# EAGLE design CK2150_BT (EAGLE 9.6.2)
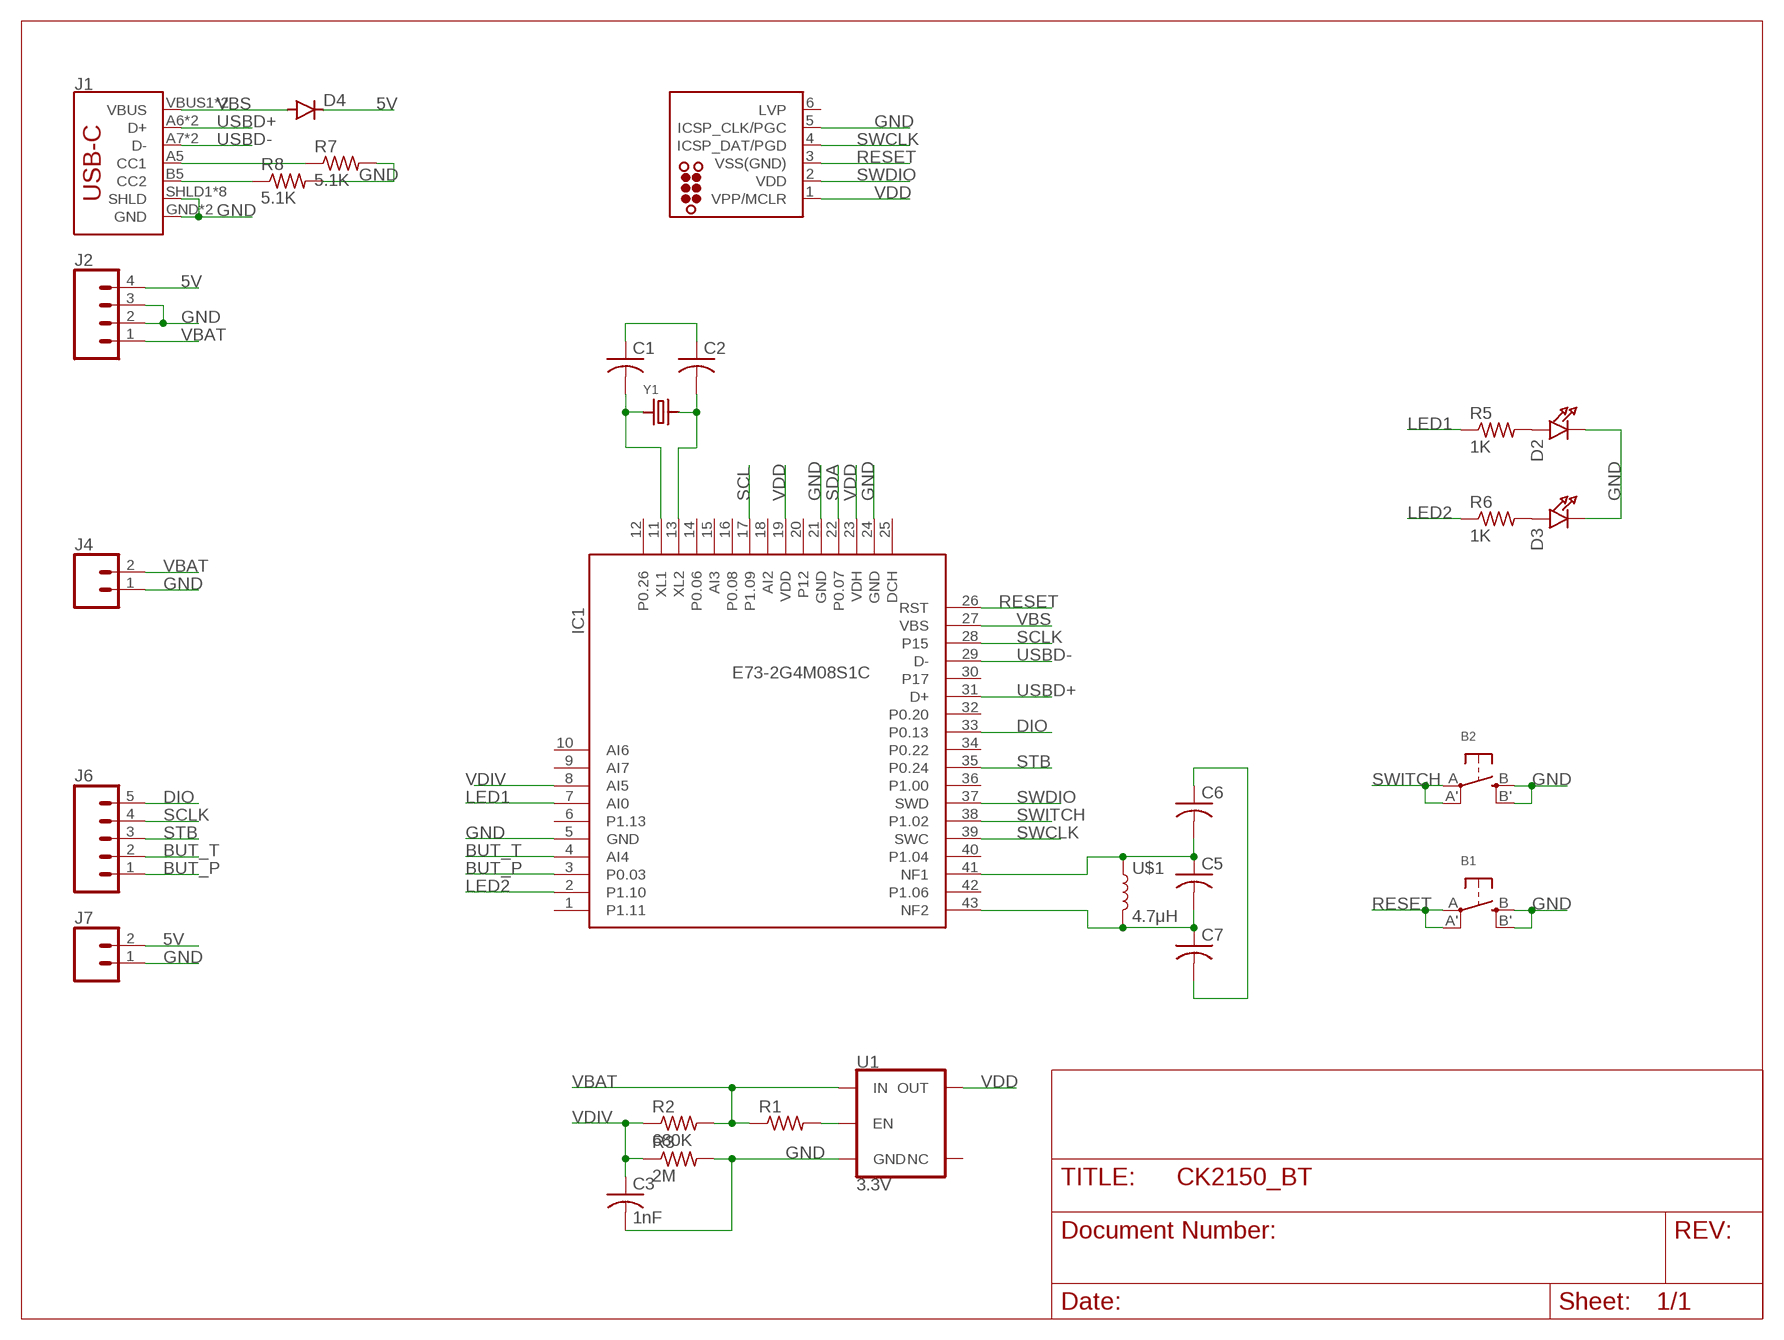
[diagram p0: schematic, sheet 1]

## Parts
B1  SWITCH_TACT_SMT4.6X2.8  [BTN_KMR2_4.6X2.8]
B2  SWITCH_TACT_SMT4.6X2.8  [BTN_KMR2_4.6X2.8]
C1  C-USC0603  [C0603]
C2  C-USC0603  [C0603]
C3  1nF  C-USC0603  [C0603]
C5  C-USC0603  [C0603]
C6  C-USC0603  [C0603]
C7  C-USC0603  [C0603]
D2  LED0805_NOOUTLINE  [CHIPLED_0805_NOOUTLINE]
D3  LED0805_NOOUTLINE  [CHIPLED_0805_NOOUTLINE]
D4  DIODE-SOD123  [SOD123]
IC1  E73-2G4M08S1C  [SMD]
J1  USB_C5  [USB-C-16P-5]
J2  CONN_041X04_NO_SILK  [1X04_NO_SILK]
J3  TC2030-MCP-NL  [TC2030-MCP-NL]
J4  CONN_021X02_NO_SILK  [1X02_NO_SILK]
J6  CONN_05NO_SILK  [1X05_NO_SILK]
J7  CONN_021X02_NO_SILK  [1X02_NO_SILK]
R1  R-US_R0603  [R0603]
R2  680K  R-US_R0603  [R0603]
R3  2M  R-US_R0603  [R0603]
R5  1K  R-US_R0603  [R0603]
R6  1K  R-US_R0603  [R0603]
R7  5.1K  R-US_R0603  [R0603]
R8  5.1K  R-US_R0603  [R0603]
U1  3.3V  V_REG_AP2112K-3.3V  [SOT23-5]
U$1  4.7μH  RFID_ANTENNA_W3102  [W3102]
Y1  CRYSTAL8X3.8SMT  [CRYSTAL_8X3.8]

## Nets
5V: D4.C J2.4 J7.2
BUT_P: IC1.3(P0.03) J6.1
BUT_T: IC1.4(AI4) J6.2
DIO: IC1.33(P0.13) J6.5
GND: B1.B'(S1) B1.B(S) B2.B'(S1) B2.B(S) C1.1 C2.1 C3.2 C6.1 C7.2 D2.C D3.C IC1.5(GND) IC1.21(GND) IC1.24(GND) J1.GND J1.GND2(GND) J1.SHLD1(SHLD) J1.SHLD2(SHLD) J1.SHLD3(SHLD) J1.SHLD4(SHLD) J1.SHLD5(SHLD) J1.SHLD6(SHLD) J1.SHLD7(SHLD) J1.SHLD8(SHLD) J2.2 J2.3 J3.5(ICSP_CLK/PGC) J4.1 J7.1 R3.2 R7.2 R8.2 U1.2(GND)
LED1: IC1.7(AI0) R5.1
LED2: IC1.2(P1.10) R6.1
N$1: R1.2 U1.3(EN)
N$2: J1.A5(CC1) R7.1
N$3: C2.2 IC1.13(XL2) Y1.P$4
N$4: D2.A R5.2
N$5: C5.1 C6.2 IC1.41(NF1) U$1.1
N$6: C5.2 C7.1 IC1.43(NF2) U$1.2
N$7: D3.A R6.2
N$8: J1.B5(CC2) R8.1
N$29: C1.2 IC1.11(XL1) Y1.P$1
RESET: B1.A'(P1) B1.A(P) IC1.26(RST) J3.3(VSS(GND))
SCL: IC1.17(P1.09)
SCLK: IC1.28(P15) J6.4
SDA: IC1.22(P0.07)
STB: IC1.35(P0.24) J6.3
SWCLK: IC1.39(SWC) J3.4(ICSP_DAT/PGD)
SWDIO: IC1.37(SWD) J3.2(VDD)
SWITCH: B2.A'(P1) B2.A(P) IC1.38(P1.02)
USBD+: IC1.31(D+) J1.A6(D+) J1.B6(D+)
USBD-: IC1.29(D-) J1.A7(D-) J1.B7(D-)
VBAT: J2.1 J4.2 R1.1 R2.2 U1.1(IN)
VBS: D4.A IC1.27(VBS) J1.VBUS1(VBUS) J1.VBUS2(VBUS)
VDD: IC1.19(VDD) IC1.23(VDH) J3.1(VPP/MCLR) U1.5(OUT)
VDIV: C3.1 IC1.8(AI5) R2.1 R3.1
Unconnected: IC1.1(P1.11) IC1.6(P1.13) IC1.9(AI7) IC1.10(AI6) IC1.12(P0.26) IC1.14(P0.06) IC1.15(AI3) IC1.16(P0.08) IC1.18(AI2) IC1.20(P12) IC1.25(DCH) IC1.30(P17) IC1.32(P0.20) IC1.34(P0.22) IC1.36(P1.00) IC1.40(P1.04) IC1.42(P1.06) J3.6(LVP) U1.4(NC)

## Library data of the parts
B1 B2 = microbuilder:SWITCH_TACT_SMT: SMT Tact Switches 6x6mm - Digikey: P12940SCT-ND KMR2 (4.6x2.8mm) - Digikey: 401-1426-1-ND EVQ-PQHB55 - Light Touch, 160GF (4.5x4.5mm) - Digikey: P8090SCT-ND
C1-C3 C5-C7 = rcl:C-US: CAPACITOR, American symbol; SPICEPREFIX: C
D2 D3 = microbuilder:LED: LED 0603 - 0603 Surface Mount Package 2mA: Green LED - Low Power (3.9mcd, 2ma, 1.7Vf) - Digikey: 475-2709-2-ND Orange LED - Low Power (9.8mcd, 2ma, 1.8Vf) - Digikey: 475-1194-2-ND Red LED - Low Power (5mcd, 2ma, 1.8Vf) - Digikey: 475-1195-2-ND Yellow LED - Low Power (7mcd, 2ma, 1.8Vf) - Digikey: 475-1196-2-ND 5mA: Blue LED - Low Power (17mcd, 5ma, 2.9Vf) - Digikey: LNJ937W8CRACT-ND 0805 - 0805 Surface Mount Package 2mA: Red LED (8.8mcd, 2mA, 1.8Vf, Clear) - Low Power [Digikey: 475-2510-1-ND] Green LED (5mcd, 2mA, 1.8Vf, Clear) - Low Power [Digikey: 475-2730-1-ND] Yellow LED (11.3mcd, 2mA, 1.8Vf, Clear) - Low Power [Digikey: 475-2555-1-ND] 20mA: Red LED (104mcd, 20mA, Diffused) - LS R976 [Digikey: 475-1278-6-ND] Red LED (12mcd, 20mA, 2.0Vf, Clear) - APT2012EC [Digikey: 754-1128-1-ND] Green LED (15mcd, 20mA, 2.2Vf, Clear) - APT2012GC [Digikey: 754-1131-1-ND] Orange LED (160mcd, 20mA, 2.1Vf, Clear) - APT2012SECK [Digikey: 754-1130-1-ND] 1206 - 1206 Surface Mount Package Green LED (26mcd, 20mA, Diffused) - LG N971 [Digikey: 475-1407-6-ND] Red LED (15mcd, 20mA, Diffused) - LH N974 [Digikey: 475-1416-6-ND]
D4 = diode:DIODE-: DIODE; LCSC: C511872
IC1 = ebyte_E73:E73-2G4M08S1C: nRF52840 2.4GHz SMD Wireless Module
J1 = USBC:USB_C: USB Type C 16Pin Connector Super Speed pins not available on the 16-pin purely SMD connector so this part is best for USB 2.0 implementations. D1 and D2 are tied together enabling D+/- no matter which way the cable is plugged into the connector. The two channel configuration pins (CC1/2) are exposed. These are normally connected to ground via 5.1k resistors but can be reconfigured for high current/high power applications.
J2 = SparkFun-Connectors:CONN_04: Multi connection point. Often used as Generic Header-pin footprint for 0.1 inch spaced/style header connections On any of the 0.1 inch spaced packages, you can populate with these: Break Away Headers - Straight <https://www.sparkfun.com/products/116> (PRT-00116) Break Away Male Headers - Right Angle <https://www.sparkfun.com/products/553> (PRT-00553) Female Headers <https://www.sparkfun.com/products/115> (PRT-00115) Break Away Headers - Machine Pin <https://www.sparkfun.com/products/117> (PRT-00117) Break Away Female Headers - Swiss Machine Pin <https://www.sparkfun.com/products/743> (PRT-00743) For SCREWTERMINALS and SPRING TERMINALS visit here: Screw Terimnals on SparkFun.com <https://www.sparkfun.com/search/results?term=Screw+Terminals> (5mm/3.5mm/2.54mm spacing) This device is also useful as a general connection point to wire up your design to another part of your project. Our various solder wires solder well into these plated through hole pads. Hook-Up Wire - Assortment (Stranded, 22 AWG) <https://www.sparkfun.com/products/11375> (PRT-11375) Hook-Up Wire - Assortment (Solid Core, 22 AWG) <https://www.sparkfun.com/products/11367> (PRT-11367) View the entire wire category on our website here <https://www.sparkfun.com/categories/141> Special notes: Molex polarized connector foot print use with SKU : PRT-08231 with associated crimp pins and housings. 1MM SMD Version SKU: PRT-10208; PROD_ID: CONN-09696
J3 = tag-connect:TC2030: TAG-CONNECT ICSP Connector Manufacturer: Tag-Connect <http://www.tag-connect.com> Cable for easy In-Circuit Serial Programming. Designed for Microchip ICD2, suitable for many others. Two variants - one "with legs" (for hands-free fit on PCB) and another "without legs" for quick programming. PAD Description 1 MCLR/Vpp 2 Vdd 3 GND 4 PGD (ISPDAT) 5 PGC (ISPCLK) 6 nc (used for LVP) ©2009 ROFA.cz - modified and updated by Robert Darlington ‹rdarlington@gmail.com›
J4 J7 = SparkFun-Connectors:CONN_02: Multi connection point. Often used as Generic Header-pin footprint for 0.1 inch spaced/style header connections On any of the 0.1 inch spaced packages, you can populate with these: Break Away Headers - Straight <https://www.sparkfun.com/products/116> (PRT-00116) Break Away Male Headers - Right Angle <https://www.sparkfun.com/products/553> (PRT-00553) Female Headers <https://www.sparkfun.com/products/115> (PRT-00115) Break Away Headers - Machine Pin <https://www.sparkfun.com/products/117> (PRT-00117) Break Away Female Headers - Swiss Machine Pin <https://www.sparkfun.com/products/743> (PRT-00743) For SCREWTERMINALS and SPRING TERMINALS visit here: Screw Terimnals on SparkFun.com <https://www.sparkfun.com/search/results?term=Screw+Terminals> (5mm/3.5mm/2.54mm spacing) This device is also useful as a general connection point to wire up your design to another part of your project. Our various solder wires solder well into these plated through hole pads. Hook-Up Wire - Assortment (Stranded, 22 AWG) <https://www.sparkfun.com/products/11375> (PRT-11375) Hook-Up Wire - Assortment (Solid Core, 22 AWG) <https://www.sparkfun.com/products/11367> (PRT-11367) View the entire wire category on our website here <https://www.sparkfun.com/categories/141> Special notes: Molex polarized connector foot print use with: PRT-08233 with associated crimp pins and housings. 2.54_SCREWTERM for use with PRT-10571. 3.5mm Screw Terminal footprints for PRT-08084 5mm Screw Terminal footprints for use with PRT-08432
J6 = SparkFun-Connectors:CONN_05: Multi connection point. Often used as Generic Header-pin footprint for 0.1 inch spaced/style header connections On any of the 0.1 inch spaced packages, you can populate with these: Break Away Headers - Straight <https://www.sparkfun.com/products/116> (PRT-00116) Break Away Male Headers - Right Angle <https://www.sparkfun.com/products/553> (PRT-00553) Female Headers <https://www.sparkfun.com/products/115> (PRT-00115) Break Away Headers - Machine Pin <https://www.sparkfun.com/products/117> (PRT-00117) Break Away Female Headers - Swiss Machine Pin <https://www.sparkfun.com/products/743> (PRT-00743) For SCREWTERMINALS and SPRING TERMINALS visit here: Screw Terimnals on SparkFun.com <https://www.sparkfun.com/search/results?term=Screw+Terminals> (5mm/3.5mm/2.54mm spacing) This device is also useful as a general connection point to wire up your design to another part of your project. Our various solder wires solder well into these plated through hole pads. Hook-Up Wire - Assortment (Stranded, 22 AWG) <https://www.sparkfun.com/products/11375> (PRT-11375) Hook-Up Wire - Assortment (Solid Core, 22 AWG) <https://www.sparkfun.com/products/11367> (PRT-11367) View the entire wire category on our website here <https://www.sparkfun.com/categories/141> Special notes: Molex polarized connector foot print use with SKU : PRT-08231 with associated crimp pins and housings. 1MM SMD Version SKU: PRT-10208
R1-R3 R5-R8 = rcl:R-US_: RESISTOR, American symbol; SPICEPREFIX: R
U1 = SparkFun-IC-Power:V_REG_AP2112: AP2112 - 600mA CMOS LDO Regulator w/ Enable The AP2112 is CMOS process low dropout linear regulator with enable function, the regulator delivers a guaranteed 600mA (min.) continuous load current. Features Output Voltage Accuracy: ±1.5% Output Current: 600mA (Min.) Foldback Short Current Protection: 50mA Enable Function to Turn ON/OFF VOUT Low Dropout Voltage (3.3V): 250mV (Typ.) @IOUT=600mA Excellent Load Regulation: 0.2%/A (Typ.) Excellent Line Regulation: 0.02%/V (Typ.) Low Quiescent Current: 55μA (Typ.) Low Standby Current: 0.01μA (Typ.) Low Output Noise: 50μVRMS PSRR: 100Hz -65dB, 1kHz -65dB OTSD Protection Stable with 1.0μF Flexible Cap: Ceramic, Tantalum and Aluminum Electrolytic Operation Temperature Range: -40°C to 85°C ESD: MM 400V, HBM 4000V; PROD_ID: VREG-12457
U$1 = SparkFun-RF:RFID_ANTENNA_W3102: W3102 Pulse Larsen NFC / RFID SMD Antenna 13.56MHz 4.7μH; PROD_ID: ANT-16333
Y1 = microbuilder:CRYSTAL: Crystals HC49UP - Surface Mount Crystal 4.0MHz 18pF +/-30ppm Surface Mount Crystal [Digikey: 535-9857-1-ND] 12.0 MHz Surface Mount Crystal [Digikey: 535-9869-6-ND] 25.0 MHz Surface Mount Crystal [Digikey: 535-9078-1-ND] 2.5 x 2.0mm - MEMs SMT Crystal 16.0 MHz 10pF 20ppm 2.5 x 2.0mm Crystal [Digikey -40-85°C: 535-10923-1-ND] 3.2 x 2.5mm - MEMs SMT Crystal 12.0 MHz 8pF 15ppm 3.2 x 2.5mm Crystal [Digikey: -10-70°C: 644-1047-1-ND -40-125°C: 644-1128-1-ND] 16.0 MHz 8pF 15ppm 3.2 x 2.5mm Crystal [Digikey: -10-70°C: 644-1049-1-ND -40-125°C: 644-1129-2-ND] 16.0 MHz 10pF 10ppm 3.2 x 2.5mm Crystal [Digikey: 644-1100-1-ND] 27.12 MHz 18pF 30ppm 3.2 x 2.5mm Crystal [Digikey: 887-1424-1-ND] 27.12MHz 10pF 10ppm 3.2 x 2.5mm Crystal [Digikey: 887-1329-1-ND] 4.9 x 1.8mm - MEMs SMT Crystal 32.768 KHz 12.5pF 20ppm 4.9 x 1.8mm Crystal [Digikey: SE2415CT-ND] 8.0 x 3.8mm - Surface Mount Crystal 32.768kHz 12.5pF 20ppm -40°C-85°C [Digikey: 535-9166-2-ND] Cylinder 32.768KHz Cylinder Crystal (2x6mm body) [Ex. Digikey: 300-8341-2-ND]

## Board
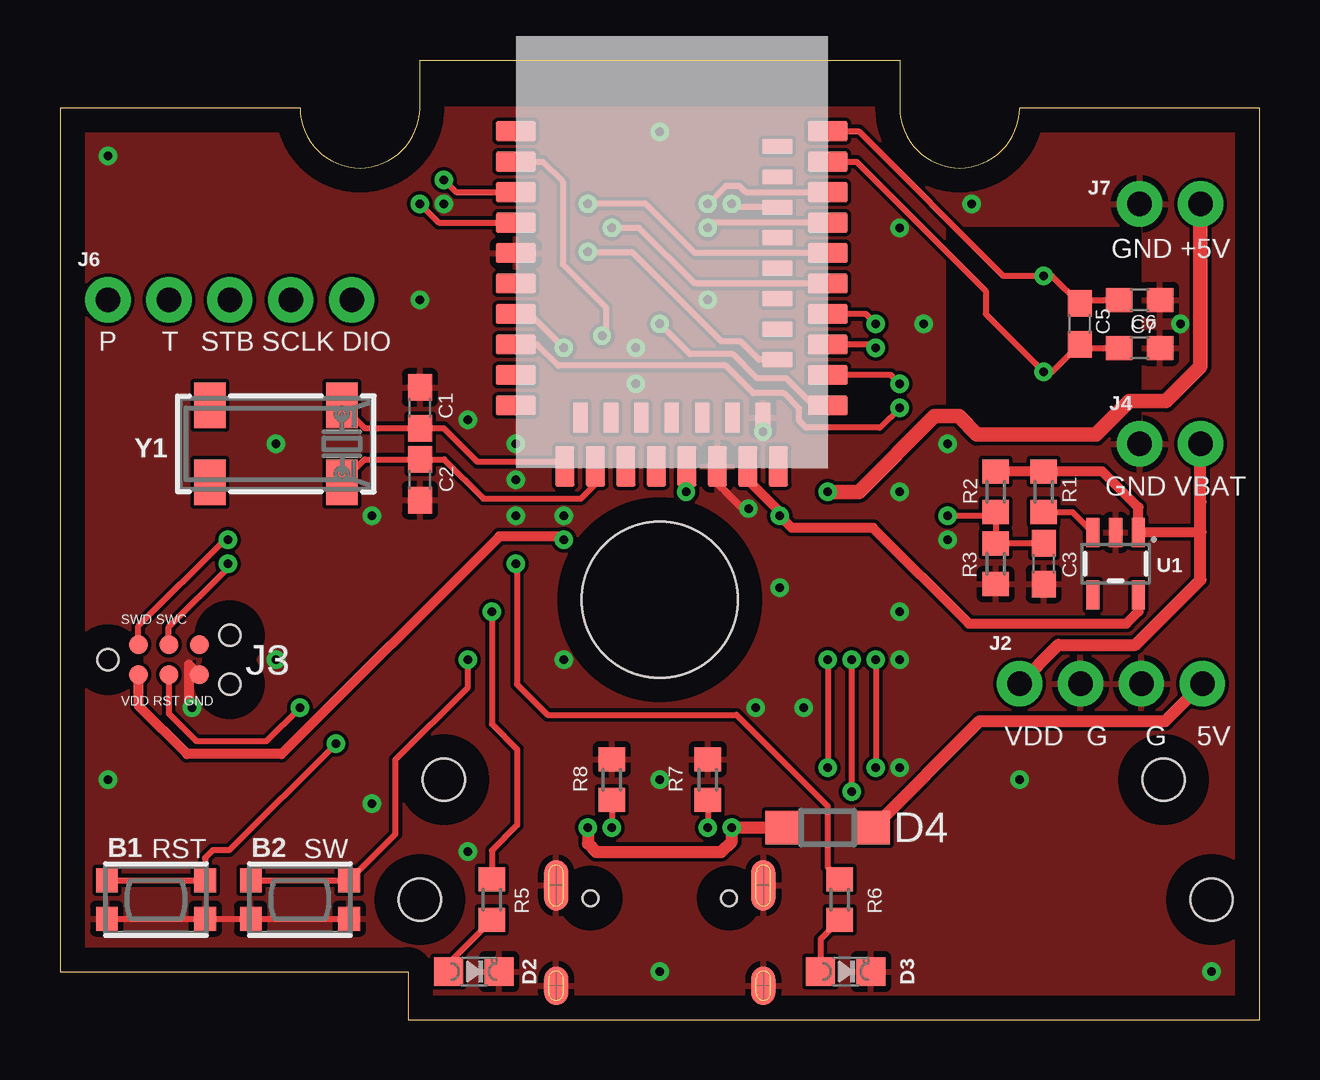
[diagram p1: board, top side]
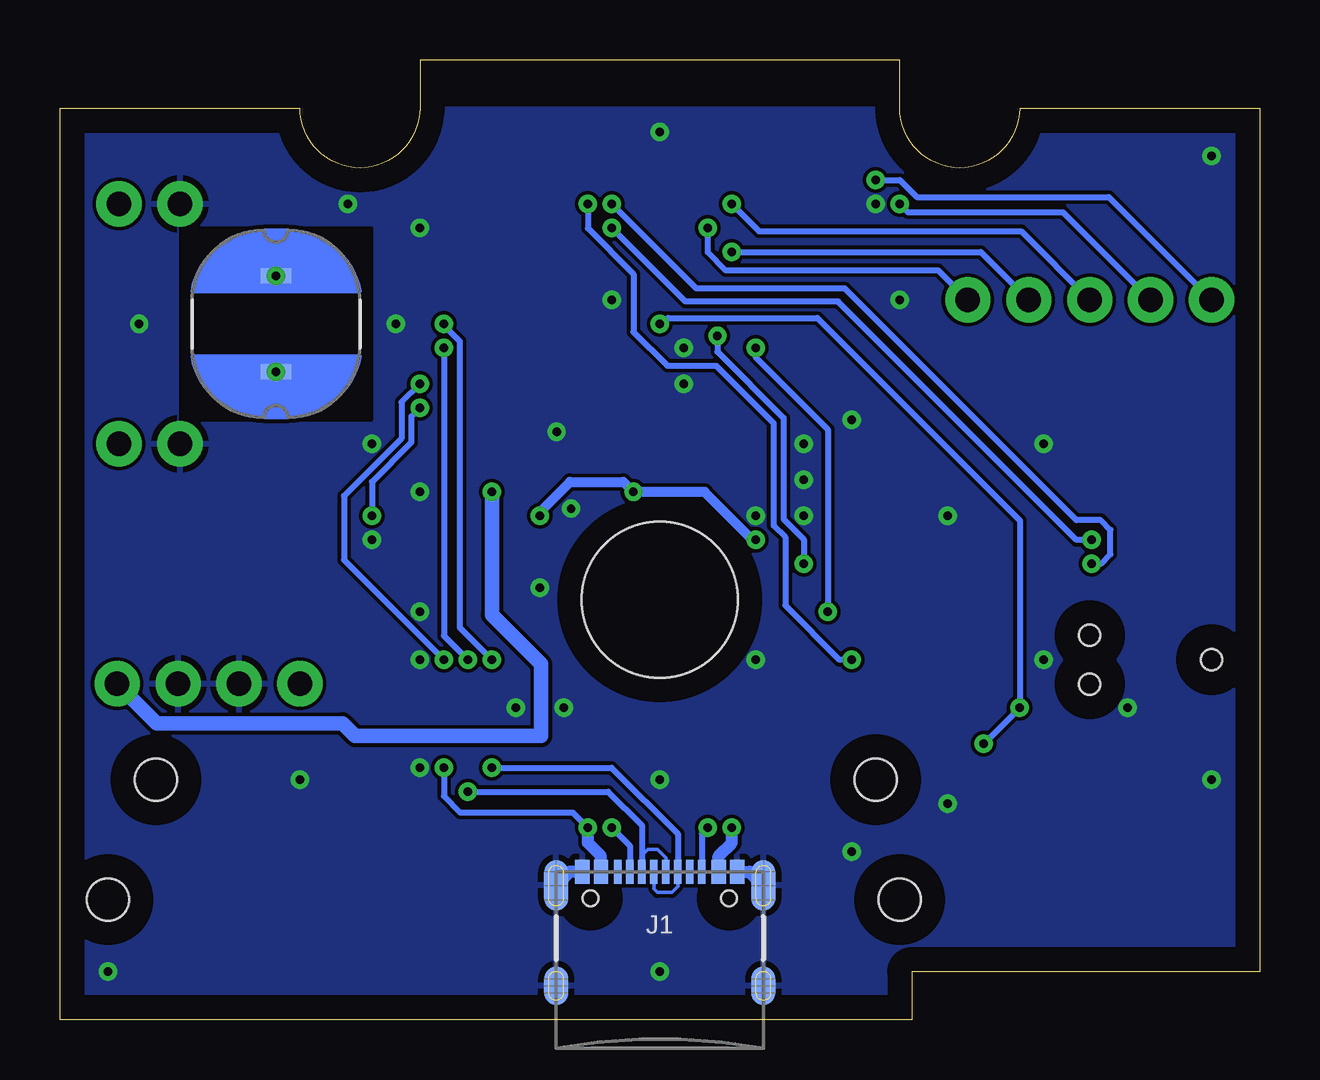
[diagram p2: board, bottom side, seen from below]

Size 50 x 40 mm. Coordinates in mm from the lower left corner, seen from the top.
Outline: 14.5,0 50,0 50,38 40,38 arc-180 35,38 35,40 15,40 15,38 arc-180 10,38 0,38 0,2 14.5,2 14.5,0
Copper layers (1*16): Top 0.035mm / dielectric 1.5mm / Bottom 0.035mm
Design rules "default *": minimum track width 6mil, minimum drill 0.35mm, track to track 6mil, track to pad 6mil, pad to pad 6mil, via to via 6mil, smd to smd 6mil, copper to edge 40mil, drill to drill 6mil, minimum pad ring 10mil, minimum via ring 8mil, stop-mask expansion 4mil, vias tented up to drill 100mil, thermal gap 10mil
Holes 1.75 mm at 15,5 48,5 16,10 46,10
Holes 6.5 mm at 25,17.5

### Footprints (pad centres in the part's own frame; a part is rotated, then mirrored left to right if it is on the bottom)
BTN_KMR2_4.6X2.8 = smd 0.9 x 1: A 2.05,0.8; A' -2.05,0.8; B 2.05,-0.8; B' -2.05,-0.8
C0603 = smd 1.1 x 1: 1 -0.85,0; 2 0.85,0
CHIPLED_0805_NOOUTLINE = smd 1.2 x 1.2: A 0,-1.05; C 0,1.05
SOD123 = smd 1.4 x 1.4: A 1.9,0; C -1.9,0
SMD = smd 1.676 x 0.813: 1 13,3.97; 2 13,5.24; 3 13,6.51; 4 13,7.78; 5 13,9.05; 6 13,10.32; 7 13,11.59; 8 13,12.86; 9 13,14.13; 10 13,15.4; 26 0,15.4; 27 0,14.13; 29 0,12.86; 31 0,11.59; 33 0,10.32; 35 0,9.05; 37 0,7.78; 39 0,6.51; 41 0,5.24; 43 0,3.97 | smd 0.813 x 1.676: 11 10.95,17.94; 13 9.68,17.94; 15 8.41,17.94; 17 7.14,17.94; 19 5.87,17.94; 21 4.6,17.94; 23 3.33,17.94; 25 2.06,17.94 | smd 0.635 x 1.27: 12 10.31,15.9; 14 9.04,15.9; 16 7.77,15.9; 18 6.5,15.9; 20 5.23,15.9; 22 3.96,15.9; 24 2.69,15.9 | smd 1.27 x 0.635: 28 2.1,13.495; 30 2.1,12.225; 32 2.1,10.955; 34 2.1,9.685; 36 2.1,8.415; 38 2.1,7.145; 40 2.1,5.875; 42 2.1,4.605
USB-C-16P-5 = smd 0.3 x 1: A5 -1.25,-0.34; A6 -0.25,-0.34; A7 0.25,-0.34; A8 1.25,-0.34; B5 1.75,-0.34; B6 0.75,-0.34; B7 -0.75,-0.34; B8 -1.75,-0.34 | smd 0.6 x 1: GND -3.225,-0.34; GND2 3.225,-0.34; VBUS1 -2.45,-0.34; VBUS2 2.45,-0.34 | smd 1 x 2.1: SHLD1 -4.32,-0.915; SHLD2 4.32,-0.915 | smd 1 x 2.1 bottom: SHLD3 -4.32,-0.915; SHLD4 4.32,-0.915 | smd 1 x 1.6: SHLD5 -4.32,-5.095; SHLD8 4.32,-5.095 | smd 1 x 1.6 bottom: SHLD6 -4.32,-5.095; SHLD7 4.32,-5.095 | hole 0.65: -2.89,-1.445; 2.89,-1.445
1X04_NO_SILK = drill 1.016 pad 1.88: 1 0,0; 2 2.54,0; 3 5.08,0; 4 7.62,0
TC2030-MCP-NL = smd 0.787 x 0.787: 1 1.27,-0.635; 2 1.27,0.635; 3 2.54,-0.635; 4 2.54,0.635; 5 3.81,-0.635; 6 3.81,0.635 | hole 0.889: 0,0; 5.08,-1.016; 5.08,1.016
1X02_NO_SILK = drill 1.016 pad 1.88: 1 0,0; 2 2.54,0
1X05_NO_SILK = drill 1.016 pad 1.88: 1 0,0; 2 2.54,0; 3 5.08,0; 4 7.62,0; 5 10.16,0
R0603 = smd 1 x 1.1: 1 -0.85,0; 2 0.85,0
SOT23-5 = smd 0.55 x 1.2: 1 -0.95,-1.3; 2 0,-1.3; 3 0.95,-1.3; 4 0.95,1.3; 5 -0.95,1.3
W3102 = smd 1.27 x 0.635: 1 0,2; 2 0,-2
CRYSTAL_8X3.8 = smd 1.3 x 1.9: P$1 -2.75,-1.6; P$2 2.75,-1.6; P$3 2.75,1.6; P$4 -2.75,1.6

### Placement (x,y rotation side)
B1  4,5 0 top
B2  10,5 0 top
C1  15,25.5 270 top
C2  15,22.5 90 top
C3  41,19 270 top
C5  42.5,29 90 top
C6  45,28 180 top
C7  45,30 0 top
D2  17.25,2 270 top
D3  32.75,2 270 top
D4  32,8 180 top
IC1  32,41 180 top
J1  25,6.5 0 bottom
J2  40,14 0 top
J3  2,15 0 top
J4  45,24 0 top
J6  2,30 0 top
J7  45,34 0 top
R1  41,22 270 top
R2  39,22 90 top
R3  39,19 270 top
R5  18,5 270 top
R6  32.5,5 270 top
R7  27,10 90 top
R8  23,10 90 top
U1  44,19 180 top
U$1  41,29 180 bottom
Y1  9,24 180 top

### Tracks (layer width: path | path; a pad name or v marks a point on that pad's centre or on a via)
5V  (via drill 0.35)
  Top 0.508: D4.C 38.35,12.45 46.07,12.45 J2.4
  Top 0.61: J7.2 47.54,27.22 46.1,25.78 44.58,25.78 43.18,24.38 38.23,24.38 37.47,25.15 36.45,25.15 33.3,22 v32,22
  Bottom 0.61: J2.4 45.97,12.35 38.22,12.35 37.69,11.81 29.95,11.81 29.95,14.82 32,16.87 v32,22
BUT_P  (via drill 0.35)
  Top 0.254: v16,35 16.51,34.49 IC1.3
  Bottom 0.254: J6.1 6.29,34.29 14.29,34.29 15,35 v16,35
BUT_T  (via drill 0.35)
  Top 0.254: v15,34 15.78,33.22 IC1.4
  Bottom 0.254: J6.2 8.2,33.66 14.65,33.66 v15,34
DIO  (via drill 0.35)
  Top 0.254: IC1.33 26.46,30.68 24.14,33 v23,33
  Bottom 0.254: J6.5 13.4,31.24 22.25,31.24 23,31.98 v23,33
GND  (via drill 0.35)
  Top 0.254: IC1.24 v29.31,24.51 v29.3,24.5 | B1.B' B1.B B2.B' B2.B
  Top 0.305: IC1.21 27.4,22.35 28.45,21.3 v28.7,21.3
  Top 0.406: J3.5 5.37,14.8 5.37,13.13 v5.5,13
  Bottom 0.508: J1.GND2 21.25,6.16 J1.SHLD2 | J1.GND 28.75,6.16 J1.SHLD3
  other vias: 2,36 16,34 25,37 27,30 36,29 37,24 37,20 30,18 35,15 40,10 48,2 25,10 25,2 17,7 13,9 9,15 21,15 19,21 19,24 35,17 35,22 46.7,29 35,33 38,34 13,21 29,13 35,10.5 31,13 2,10 9,24 15,30 17,25 19,22.5 21,21 24,28 24,26.5
  pour Top: 0,38 50,38 50,0 2,0 0,2
  pour Bottom: 0,38 50,38 50,0 3,0 0,3
  cutout Bottom: 37,30 37,33 45,33 45,25 37,25
  cutout Top: 37,33 45,33 45,25 37,25
LED1  (via drill 0.35)
  Top 0.254: v18,17 18,12.32 19.06,11.26 19.06,8.11 18,7.05 R5.1 | IC1.7 19.59,29.41 v21,28
  Bottom 0.254: v18,17 18,24.6 21,27.6 v21,28
LED2  (via drill 0.35)
  Top 0.254: v19,19 19.05,18.95 19.05,13.97 20.32,12.7 28.19,12.7 31.99,8.9 31.99,6.36 R6.1 | IC1.2 20.12,35.76 20.96,34.92 20.96,31.47 22.76,29.67 22.76,28.66 v22.6,28.5
  Bottom 0.254: v22.6,28.5 22.6,27.84 19.84,25.08 19.84,20.86 19,20.02 v19,19
N$1
  Top 0.254: R1.2 42.2,21.15 U1.3
N$2  (via drill 0.35)
  Top 0.254: R7.1 v27,8
  Bottom 0.254: v27,8 26.25,7.25 J1.A5
N$3
  Top 0.254: Y1.P$4 12.7,23.35 C2.2 16.02,23.35 17.65,21.72 21.72,21.72 22.32,22.32 IC1.13
N$4
  Top 0.254: R5.2 16.2,2.35 D2.A
N$5  (via drill 0.35)
  Top 0.254: IC1.41 33.2,35.76 38.59,30.37 38.59,29.41 U$1.1 41.35,27 C5.1 42.65,28 C6.2
  other vias: 41,27
N$6  (via drill 0.35)
  Top 0.254: IC1.43 33.3,37.03 39.33,31 U$1.2 41.35,31 C5.2 42.65,30 C7.1
  other vias: 41,31
N$7
  Top 0.254: R6.2 31.7,3.35 D3.A
N$8  (via drill 0.35)
  Top 0.254: R8.1 v23,8
  Bottom 0.254: v23,8 23.25,7.75 J1.B5
N$29
  Top 0.254: Y1.P$1 12.7,24.65 C1.2 15.99,24.65 17.4,23.24 20.87,23.24 IC1.11
RESET  (via drill 0.35)
  Top 0.254: v25,29 26.27,27.73 28.05,27.73 29.04,26.74 30.26,26.74 31.4,25.6 IC1.26 | B1.A' B1.A 6.05,6.73 6.37,7.05 7.05,7.05 v11.5,11.5 | J3.3 4.54,12.76 5.69,11.6 8.6,11.6 v10,13
  Bottom 0.254: v25,29 24.65,29.25 18.44,29.25 9.98,20.79 9.98,13.02 v10,13 v11.5,11.5
SCLK  (via drill 0.35)
  Top 0.254: v22,32 23.84,32 27.57,28.27 28.38,28.27 29.14,27.5 IC1.28
  Bottom 0.254: v22,32 11.62,32 J6.4
STB  (via drill 0.35)
  Top 0.254: IC1.35 26.47,31.95 24.4,34.02 22.02,34.02 v22,34
  Bottom 0.254: J6.3 9.94,32.86 20.86,32.86 v22,34
SWCLK  (via drill 0.35)
  Top 0.254: v27,34 27.74,34.74 28.32,34.74 28.57,34.49 IC1.39 | J3.4 4.54,16.36 7,18.82 v7,19
  Bottom 0.254: v27,34 23.47,30.47 17.29,30.47 7.63,20.82 6.62,20.82 6.21,20.41 6.21,19.4 6.62,19 v7,19
SWDIO  (via drill 0.35)
  Top 0.254: v27,33 27.22,33.22 IC1.37 | J3.2 3.27,16.4 6.87,20 v7,20
  Bottom 0.254: v27,33 23.94,29.94 17.57,29.94 7.63,20 v7,20
SWITCH  (via drill 0.35)
  Top 0.254: IC1.38 28.14,33.85 v28,34 | v17,15 17,13.85 13.98,10.84 13.98,7.73 B2.A B2.A'
  Bottom 0.254: v28,34 28,32.98 26.09,31.08 26.09,28.67 24.69,27.26 22.65,27.26 20.25,24.86 20.25,20.59 19.77,20.11 19.77,17.26 17.51,15 v17,15
USBD+  (via drill 0.35)
  Top 0.254: v34,29 33.59,29.41 IC1.31 | v32,15 v32,10.5
  Bottom 0.152: J1.B6 24.25,6.1 24.25,5.55 24.5,5.3 25.1,5.3 25.25,5.45 J1.A6
  Bottom 0.254: v34,29 34,28.93 33.34,28.27 33.34,16.34 v32,15 | 24.25,6.1 24.25,7.74 27.01,10.5 v32,10.5
USBD-  (via drill 0.35)
  Top 0.254: v34,28 33.86,28.14 IC1.29 | v33,9.5 v33,15
  Bottom 0.152: J1.A7 24.75,6.75 25.1,7.1 25.5,7.1 25.75,6.85 25.75,6.22 J1.B7
  Bottom 0.254: v34,28 34,16 v33,15 | 25.75,6.22 25.75,8.1 27.15,9.5 v33,9.5
VBAT
  Top 0.406: R2.2 R1.1 43.44,22.85 44.95,21.34 U1.1 44.97,20.32 47.54,20.32
  Top 0.508: J2.1 41.62,15.62 44.83,15.62 47.54,18.33 47.54,20.32 47.54,21.59 J4.2
VBS  (via drill 0.35)
  Top 0.254: IC1.27 34.63,26.87 v35,26.5 | v34,15 v34,10.5
  Top 0.508: v22,8 22,7.34 22.35,6.99 27.56,6.99 28,7.43 v28,8 D4.A
  Bottom 0.254: v34,10.5 34,9.32 33.32,8.63 28.64,8.63 v28,8 | v34,15 38.16,19.16 38.16,21.83 35.76,24.22 35.76,25.74 v35,26.5
  Bottom 0.508: J1.VBUS2 22.55,6.82 22,7.37 v22,8 | J1.VBUS1 27.45,6.82 28,7.37 v28,8
VDD  (via drill 0.35)
  Top 0.406: U1.5 44.95,17.01 44.45,16.51 37.88,16.51 33.9,20.49 30.51,20.49 v30,21 30,21.16 28.67,22.49 IC1.23 | J3.1 3.27,13.1 5.3,11.06 9.24,11.06 18.32,20.14 20.86,20.14 v21,20 | v26.1,22 26.1,23.03 IC1.19
  Bottom 0.406: v21,20 21.13,20 23.13,22 v26.1,22 26.52,22.41 28.75,22.41 30,21.16 v30,21
VDIV  (via drill 0.35)
  Top 0.254: v35,25.5 34.17,24.68 31.1,24.68 30.81,24.97 30.81,25.48 30.18,26.11 28.91,26.11 27.76,27.25 20.78,27.25 19.89,28.14 IC1.8 | v37,21 38.85,21 R2.1 R3.1 C3.1
  Bottom 0.254: v35,25.5 35.36,25.14 35.36,24.05 37,22.41 v37,21

### Text on the board
tPlace: GND +5V | P T STB SCLK DIO | GND VBAT | SWD SWC | VDD RST GND | VDD G G 5V | RST SW